# EAGLE design handlauf (EAGLE 9.6.2)
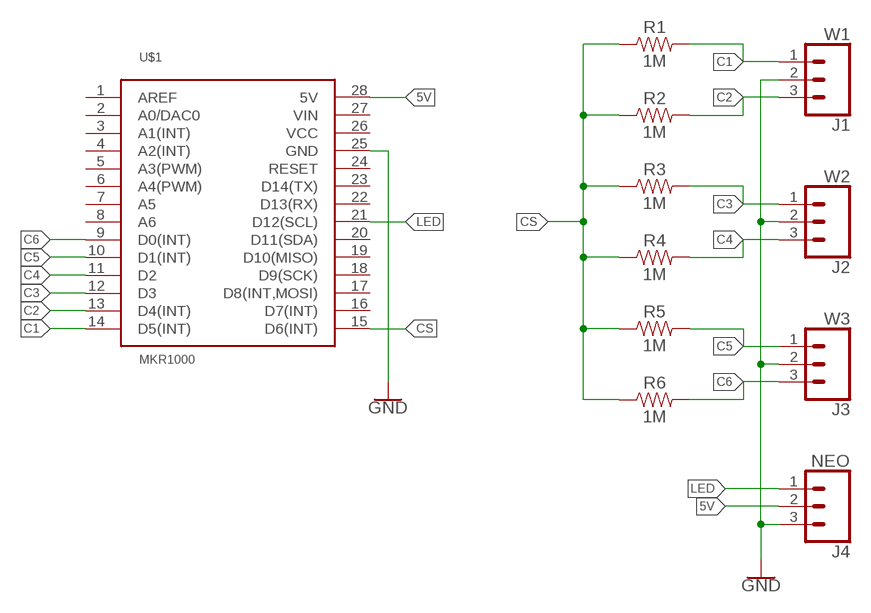
[diagram p0: schematic, sheet 1]

## Parts
J1  W1  CONN_03SCREW  [SCREWTERMINAL-3.5MM-3]
J2  W2  CONN_03SCREW  [SCREWTERMINAL-3.5MM-3]
J3  W3  CONN_03SCREW  [SCREWTERMINAL-3.5MM-3]
J4  NEO  CONN_03  [1X03]
R1  1M  RESISTORAXIAL-0.3  [AXIAL-0.3]
R2  1M  RESISTORAXIAL-0.3  [AXIAL-0.3]
R3  1M  RESISTORAXIAL-0.3  [AXIAL-0.3]
R4  1M  RESISTORAXIAL-0.3  [AXIAL-0.3]
R5  1M  RESISTORAXIAL-0.3  [AXIAL-0.3]
R6  1M  RESISTORAXIAL-0.3  [AXIAL-0.3]
U$1  MKR1000  [MKR1000-SOCKET]

## Nets
5V: J4.2 U$1.28(5V)
C1: J1.1 R1.P$2 U$1.14(D5(INT))
C2: J1.3 R2.P$2 U$1.13(D4(INT))
C3: J2.1 R3.P$2 U$1.12(D3)
C4: J2.3 R4.P$2 U$1.11(D2)
C5: J3.1 R5.P$2 U$1.10(D1(INT))
C6: J3.3 R6.P$2 U$1.9(D0(INT))
CS: R1.P$1 R2.P$1 R3.P$1 R4.P$1 R5.P$1 R6.P$1 U$1.15(D6(INT))
GND: J1.2 J2.2 J3.2 J4.3 U$1.25(GND)
LED: J4.1 U$1.21(D12(SCL))
Unconnected: U$1.1(AREF) U$1.2(A0/DAC0) U$1.3(A1(INT)) U$1.4(A2(INT)) U$1.5(A3(PWM)) U$1.6(A4(PWM)) U$1.7(A5) U$1.8(A6) U$1.16(D7(INT)) U$1.17(D8(INT,MOSI)) U$1.18(D9(SCK)) U$1.19(D10(MISO)) U$1.20(D11(SDA)) U$1.22(D13(RX)) U$1.23(D14(TX)) U$1.24(RESET) U$1.26(VCC) U$1.27(VIN)

## Library data of the parts
J1-J3 = SparkFun-Connectors:CONN_03: Multi connection point. Often used as Generic Header-pin footprint for 0.1 inch spaced/style header connections On any of the 0.1 inch spaced packages, you can populate with these: Break Away Headers - Straight <https://www.sparkfun.com/products/116> (PRT-00116) Break Away Male Headers - Right Angle <https://www.sparkfun.com/products/553> (PRT-00553) Female Headers <https://www.sparkfun.com/products/115> (PRT-00115) Break Away Headers - Machine Pin <https://www.sparkfun.com/products/117> (PRT-00117) Break Away Female Headers - Swiss Machine Pin <https://www.sparkfun.com/products/743> (PRT-00743) Stackable Header - 3 Pin (Female, 0.1") <https://www.sparkfun.com/products/13875> (PRT-13875) For SCREWTERMINALS and SPRING TERMINALS visit here: Screw Terimnals on SparkFun.com <https://www.sparkfun.com/search/results?term=Screw+Terminals> (5mm/3.5mm/2.54mm spacing) This device is also useful as a general connection point to wire up your design to another part of your project. Our various solder wires solder well into these plated through hole pads. Hook-Up Wire - Assortment (Stranded, 22 AWG) <https://www.sparkfun.com/products/11375> (PRT-11375) Hook-Up Wire - Assortment (Solid Core, 22 AWG) <https://www.sparkfun.com/products/11367> (PRT-11367) View the entire wire category on our website here <https://www.sparkfun.com/categories/141> Special notes: Molex polarized connector foot print use with SKU : PRT-08232 with associated crimp pins and housings.; PROD_ID: CONN-08288; SF_ID: PRT-08235
J4 = SparkFun-Connectors:CONN_03: Multi connection point. Often used as Generic Header-pin footprint for 0.1 inch spaced/style header connections On any of the 0.1 inch spaced packages, you can populate with these: Break Away Headers - Straight <https://www.sparkfun.com/products/116> (PRT-00116) Break Away Male Headers - Right Angle <https://www.sparkfun.com/products/553> (PRT-00553) Female Headers <https://www.sparkfun.com/products/115> (PRT-00115) Break Away Headers - Machine Pin <https://www.sparkfun.com/products/117> (PRT-00117) Break Away Female Headers - Swiss Machine Pin <https://www.sparkfun.com/products/743> (PRT-00743) Stackable Header - 3 Pin (Female, 0.1") <https://www.sparkfun.com/products/13875> (PRT-13875) For SCREWTERMINALS and SPRING TERMINALS visit here: Screw Terimnals on SparkFun.com <https://www.sparkfun.com/search/results?term=Screw+Terminals> (5mm/3.5mm/2.54mm spacing) This device is also useful as a general connection point to wire up your design to another part of your project. Our various solder wires solder well into these plated through hole pads. Hook-Up Wire - Assortment (Stranded, 22 AWG) <https://www.sparkfun.com/products/11375> (PRT-11375) Hook-Up Wire - Assortment (Solid Core, 22 AWG) <https://www.sparkfun.com/products/11367> (PRT-11367) View the entire wire category on our website here <https://www.sparkfun.com/categories/141> Special notes: Molex polarized connector foot print use with SKU : PRT-08232 with associated crimp pins and housings.
R1-R6 = SparkFun-Resistors:RESISTOR: Generic Resistor Package
U$1 = IAD-Library:MKR1000: The Arduino MKR1000.

## Board
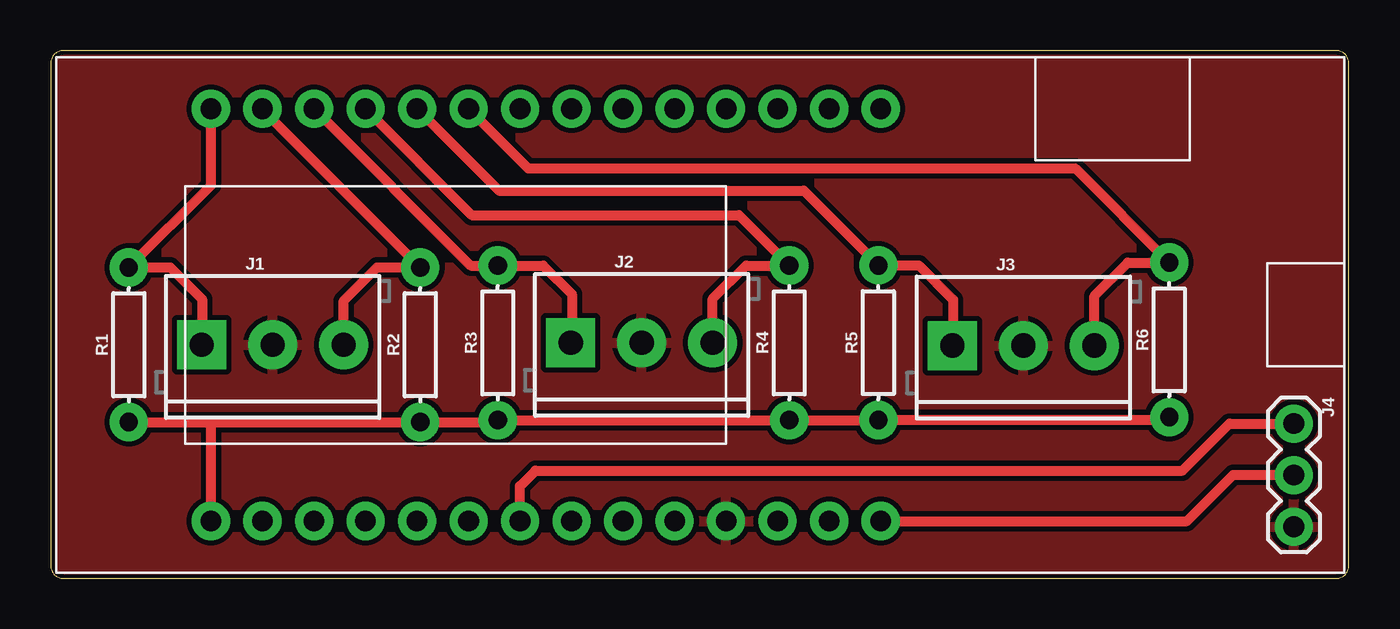
[diagram p1: board, top side]
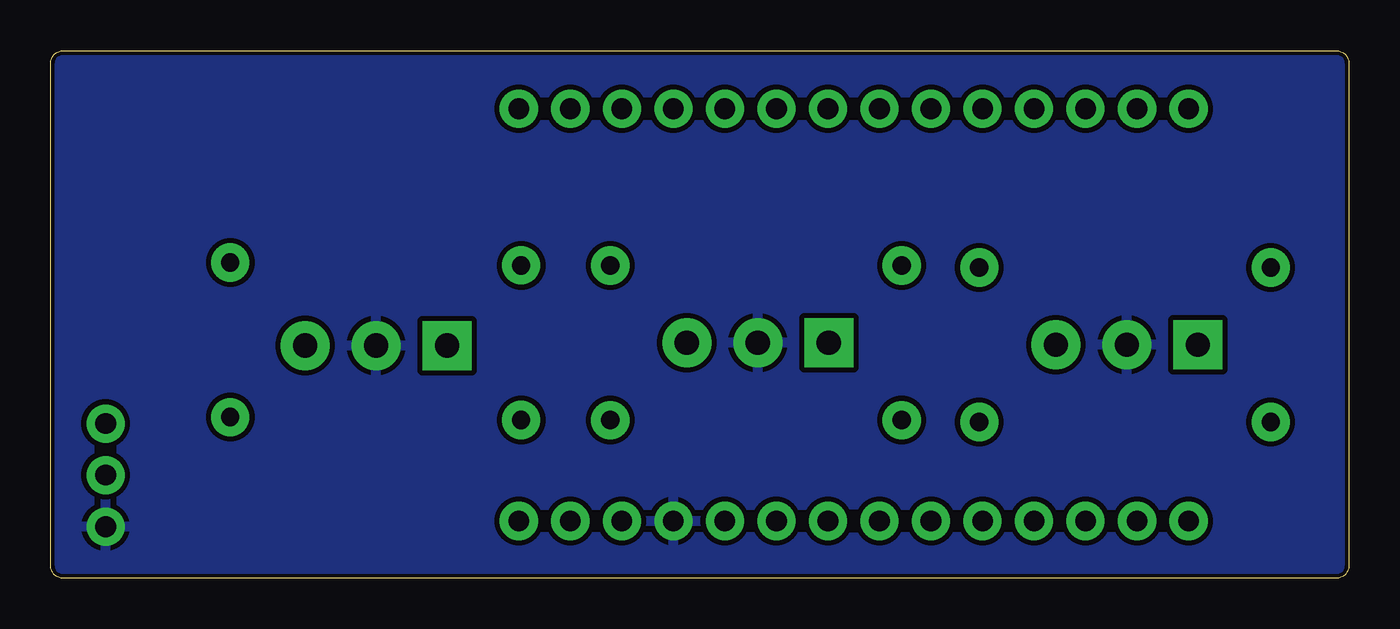
[diagram p2: board, bottom side, seen from below]

Size 64 x 26 mm. Coordinates in mm from the lower left corner, seen from the top.
Outline: 0.6,0 63.4,0 arc90 64,0.6 64,25.4 arc90 63.4,26 0.6,26 arc90 0,25.4 0,0.6 arc90 0.6,0
Copper layers (1*16): Top 0.035mm / dielectric 1.5mm / Bottom 0.035mm
Design rules "SparkFun-2-layer-STANDARD": minimum track width 10mil, minimum drill 20mil, track to track 10mil, track to pad 8mil, pad to pad 8mil, via to via 10mil, smd to smd 8mil, copper to edge 8mil, drill to drill 8mil, minimum pad ring 10mil, minimum via ring 10mil, stop-mask expansion 4mil, vias tented up to drill 25mil, thermal gap 10mil

### Footprints (pad centres in the part's own frame; a part is rotated, then mirrored left to right if it is on the bottom)
SCREWTERMINAL-3.5MM-3 = drill 1.2 pad 2.413 square: 1 0,0 | drill 1.2 pad 2.413: 2 3.5,0; 3 7,0
1X03 = drill 1.016 pad 1.88: 1 0,0; 2 2.54,0; 3 5.08,0
AXIAL-0.3 = drill 0.9 pad 1.88: P$1 -3.81,0; P$2 3.81,0
MKR1000-SOCKET = drill 1.016 pad 1.88: 1 -16.51,-10.16; 2 -13.97,-10.16; 3 -11.43,-10.16; 4 -8.89,-10.16; 5 -6.35,-10.16; 6 -3.81,-10.16; 7 -1.27,-10.16; 8 1.27,-10.16; 9 3.81,-10.16; 10 6.35,-10.16; 11 8.89,-10.16; 12 11.43,-10.16; 13 13.97,-10.16; 14 16.51,-10.16; 15 16.51,10.16; 16 13.97,10.16; 17 11.43,10.16; 18 8.89,10.16; 19 6.35,10.16; 20 3.81,10.16; 21 1.27,10.16; 22 -1.27,10.16; 23 -3.81,10.16; 24 -6.35,10.16; 25 -8.89,10.16; 26 -11.43,10.16; 27 -13.97,10.16; 28 -16.51,10.16

### Placement (x,y rotation side)
J1  7.44,11.51 0 top
J2  25.64,11.6 0 top
J3  44.46,11.47 0 top
J4  61.29,7.62 270 top
R1  3.85,11.51 90 top
R2  18.22,11.51 90 top
R3  22.04,11.6 90 top
R4  36.41,11.6 90 top
R5  40.81,11.61 90 top
R6  55.15,11.75 90 top
U$1  24.41,12.98 180 top

### Tracks (layer width: path | path; a pad name or v marks a point on that pad's centre or on a via)
5V
  Top 0.5: J4.2 61.27,5.1 58.3,5.1 56.02,2.82 U$1.28
C1
  Top 0.5: 5.9,15.32 7.46,13.76 7.46,11.52 J1.1 | U$1.14 7.9,19.37 R1.P$2 5.9,15.32 | 5.9,15.32
C2
  Top 0.5: J1.3 14.44,13.67 16.09,15.32 R2.P$2 10.44,23.1 U$1.13
C3
  Top 0.5: J2.1 25.7,11.67 25.7,14 24.29,15.41 R3.P$2 20.71,15.41 U$1.12
C4
  Top 0.5: J2.3 32.64,13.77 34.28,15.41 R4.P$2 33.93,17.9 20.76,17.9 U$1.11
C5
  Top 0.5: J3.1 44.48,11.5 44.48,13.73 42.8,15.42 R5.P$2 37.13,19.1 22.1,19.1 U$1.10
C6
  Top 0.5: J3.3 51.46,13.91 53.1,15.56 R6.P$2 50.51,20.2 23.54,20.2 U$1.9
CS
  Top 0.5: R1.P$1 7.9,7.7 | 7.9,7.7 R2.P$1 21.95,7.7 R3.P$1 R4.P$1 R5.P$1 55.01,7.8 R6.P$1 | U$1.15 7.9,7.7
GND
  pour Bottom: -0.2,26.2 64.2,26.2 64.2,-0.2 -0.2,-0.2
  pour Top: -0.6,26.6 64.6,26.6 64.6,-0.6 -0.6,-0.6
LED
  Top 0.5: U$1.21 23.14,4.54 23.9,5.3 55.8,5.3 58.12,7.62 J4.1